# Altium schematic sheet switches.SchDoc
size A4
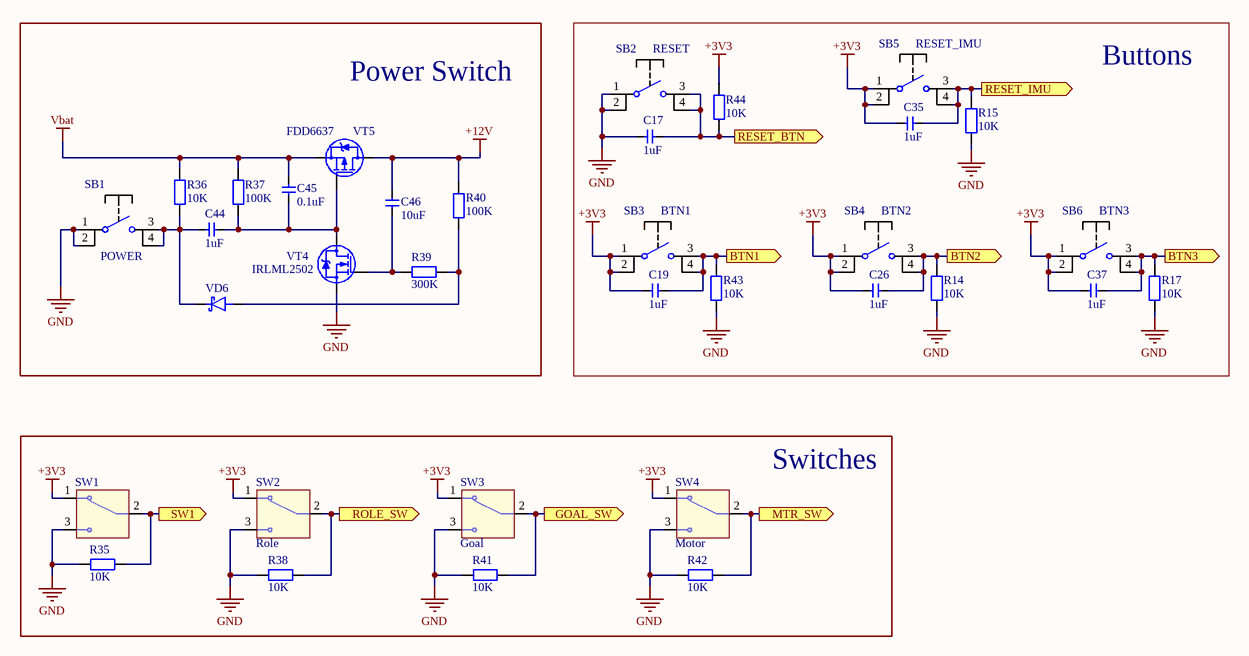
[diagram p0: switches.SchDoc]

## Parts
C17  1uF  [CAP0805]
C19  1uF  [CAP0805]
C26  1uF  [CAP0805]
C35  1uF  [CAP0805]
C37  1uF  [CAP0805]
C44  1uF  [CAP0805]
C45  0.1uF  [CAP0805]
C46  10uF  [CAP0805]
R14  10K  [RES0805]
R15  10K  [RES0805]
R17  10K  [RES0805]
R35  10K  [RES0805]
R36  10K  [RES0805]
R37  100K  [RES0805]
R38  10K  [RES0805]
R39  300K  [RES0805]
R40  100K  [RES0805]
R41  10K  [RES0805]
R42  10K  [RES0805]
R43  10K  [RES0805]
R44  10K  [RES0805]
SB1  POWER  [DTSM-61N-V-T/R]
SB2  RESET  [DTSM-61N-V-T/R]
SB3  BTN1  [DTSM-61N-V-T/R]
SB4  BTN2  [DTSM-61N-V-T/R]
SB5  RESET_IMU  [DTSM-61N-V-T/R]
SB6  BTN3  [DTSM-61N-V-T/R]
SW1  ESP1010  [ESP1010]  (value not drawn)
SW2  Role  [ESP1010]
SW3  Goal  [ESP1010]
SW4  Motor  [ESP1010]
VD6  Diode Schottky  [DO-214AC (SMA)]  (value not drawn)
VT4  IRLML2502  [SOT-23-3]
VT5  FDD6637  [DPAK]

## Blocks framed on the sheet
Power Switch: C44-C46 R36 R37 R39 R40 SB1 VD6 VT4 VT5
Buttons: C17 C19 C26 C35 C37 R14 R15 R17 R43 R44 SB2-SB6
Switches: R35 R38 R41 R42 SW1-SW4

## Ports
BTN1 (out), BTN2 (out), BTN3 (out), GOAL_SW (out), MTR_SW (out), RESET_BTN (out), RESET_IMU (out), ROLE_SW (out), SW1 (out)

## Nets
+3V3: C19.1 C26.1 C35.1 C37.1 R44.2 SB3.1 SB3.2 SB4.1 SB4.2 SB5.1 SB5.2 SB6.1 SB6.2 SW1.1 SW2.1 SW3.1 SW4.1
+12V: C46.2 R40.2 VT5.D
GND: C17.1 R14.1 R15.1 R17.1 R35.1 R38.1 R41.1 R42.1 R43.1 SB1.1 SB1.2 SB2.1 SB2.2 SW1.3 SW2.3 SW3.3 SW4.3 VT4.S
Vbat: C45.2 R36.1 R37.1 VT5.S
BTN1: C19.2 R43.2 SB3.3 SB3.4 ; port BTN1
BTN2: C26.2 R14.2 SB4.3 SB4.4 ; port BTN2
BTN3: C37.2 R17.2 SB6.3 SB6.4 ; port BTN3
GOAL_SW: R41.2 SW3.2 ; port GOAL_SW
MTR_SW: R42.2 SW4.2 ; port MTR_SW
RESET_BTN: C17.2 R44.1 SB2.3 SB2.4 ; port RESET_BTN
RESET_IMU: C35.2 R15.2 SB5.3 SB5.4 ; port RESET_IMU
ROLE_SW: R38.2 SW2.2 ; port ROLE_SW
SW1: R35.2 SW1.2 ; port SW1
NetC44_1: C44.1 C45.1 R37.2 VT4.D VT5.G
NetC44_2: C44.2 R36.2 SB1.3 SB1.4 VD6.K
NetC46_1: C46.1 R39.2 VT4.G
NetR39_1: R39.1 R40.1 VD6.A

## Library data of the parts
C17 C19 C26 C35 C37 C44-C46 = CAP Ceramic: Ceramic SMD Cap
R14 R15 R17 R35-R44 = RES: RES smd
SB1-SB6 = Button
SW1-SW4 = ESP1010: 2 pos switch; ComponentLink1Description: Chipdip; ComponentLink1URL: https://www.chipdip.ru/product0/8007034319
VT4 = IRLML2502: N-MOSFET / Uds = 20 V / Ids = 4.2 A / Rds = 0.035 Ohm / P = 8 W; ComponentLink1Description: Chipdip; ComponentLink1URL: https://www.chipdip.ru/product/irlml2502-umw
VT5 = FDD6637: P-MOSFET / Uds = 40 V / Ids = 40 A / Rds = 0.012 Ohm / P = 3.0 W; ComponentLink1Description: Chipdip; ComponentLink1URL: https://www.chipdip.ru/product/fdd6637-vbsemi